# Altium schematic sheet Arduino_Shield.SchDoc
size A4; SheetNumber: 1; SheetTotal: 1
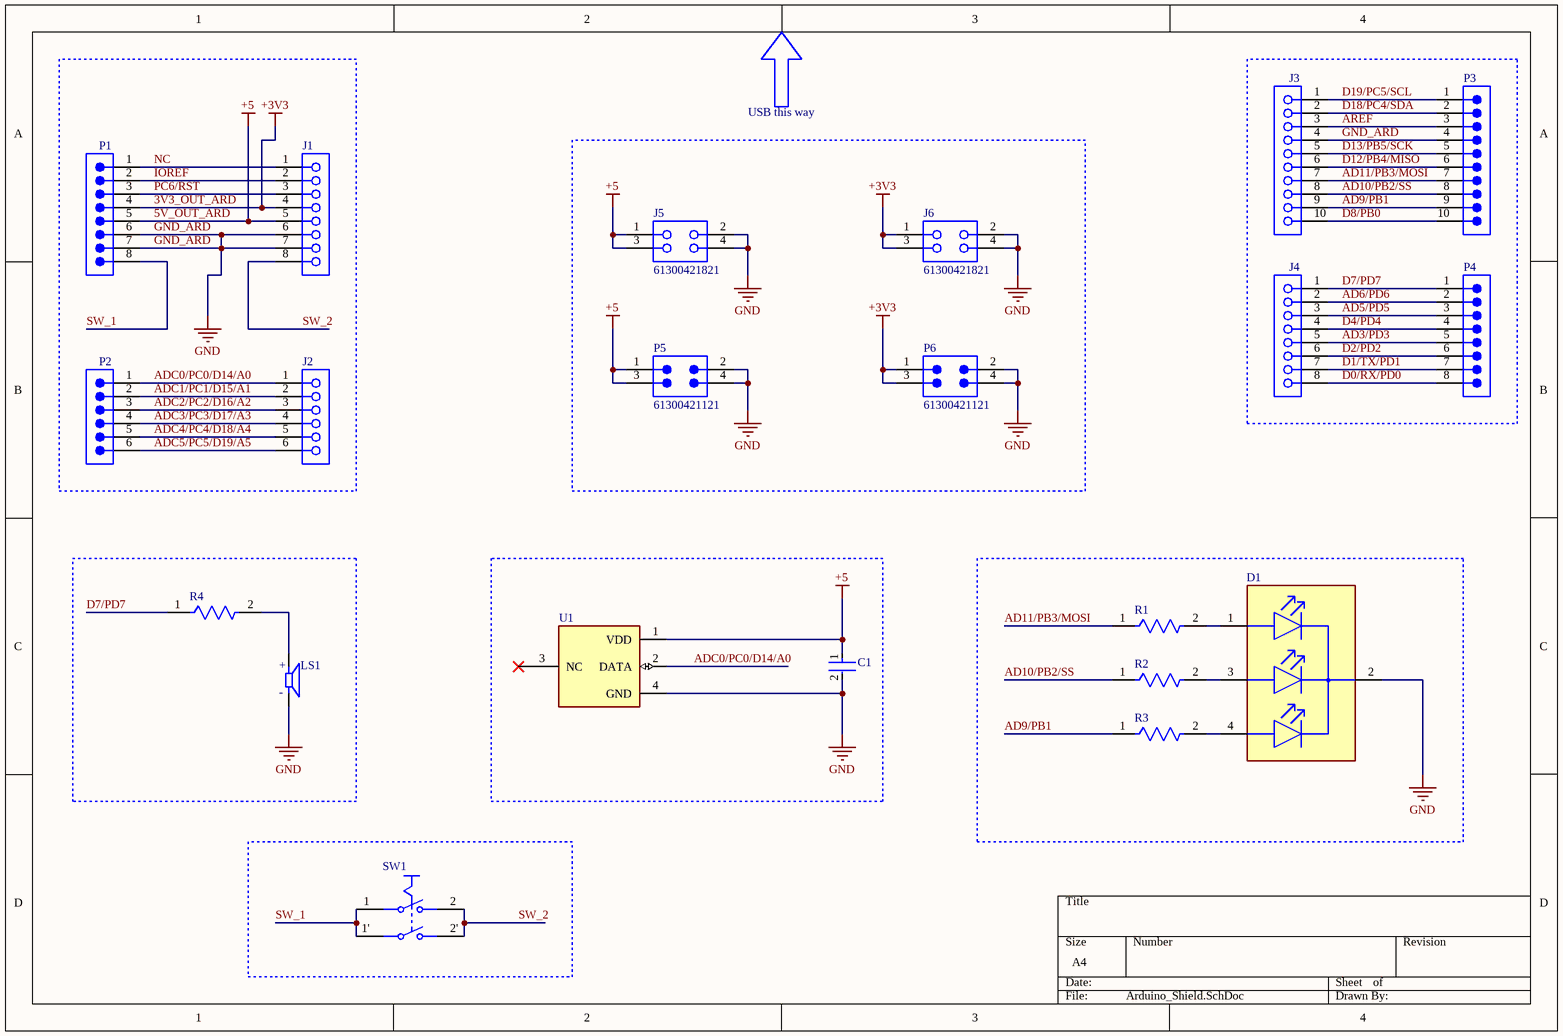
[diagram p0: Arduino_Shield.SchDoc]

## Parts
C1  C0402C104K4RACAUTO  [FP-C0402-BB-MFG]  (value not drawn)
D1  AAA3528LSEKJ3ZGKQBKS  [FP-AAA3528LSEKJ3ZGKQBKS-MFG]  (value not drawn)
J1  61300811821  [61300811821]  (value not drawn)
J2  61300611821  [61300611821]  (value not drawn)
J3  61301011821  [61301011821]  (value not drawn)
J4  61300811821  [61300811821]  (value not drawn)
J5  61300421821  [61300421821]
J6  61300421821  [61300421821]
LS1  CST-951AP  [CUI_CST-951AP]  (value not drawn)
P1  61300811121  [61300811121]  (value not drawn)
P2  61300611121  [61300611121]  (value not drawn)
P3  61301011121  [61301011121]  (value not drawn)
P4  61300811121  [61300811121]  (value not drawn)
P5  61300421121  [61300421121]
P6  61300421121  [61300421121]
R1  CPF0603F1K0C1  [FP-CPF0603-MFG]  (value not drawn)
R2  CPF0603F1K0C1  [FP-CPF0603-MFG]  (value not drawn)
R3  CPF0603F1K0C1  [FP-CPF0603-MFG]  (value not drawn)
R4  CPF0603F1K0C1  [FP-CPF0603-MFG]  (value not drawn)
SW1  PVA1EEH11.2NV2  [FP-PVA1EEH11_2NV2-MFG]  (value not drawn)
U1  ADA386  [XDCR_ADA386]  (value not drawn)

## Nets
3V3_OUT_ARD: J1.4 J6.1 J6.3 P1.4 P6.1 P6.3  [also labelled +3V3]
5V_OUT_ARD: C1.1 J1.5 J5.1 J5.3 P1.5 P5.1 P5.3 U1.1(VDD)  [also labelled +5]
GND_ARD: C1.2 D1.2(COMMON_CATHODE) J1.6 J1.7 J3.4 J5.2 J5.4 J6.2 J6.4 LS1.M P1.6 P1.7 P3.4 P5.2 P5.4 P6.2 P6.4 U1.4(GND)  [also labelled GND]
AD3/PD3: J4.5 P4.5
AD5/PD5: J4.3 P4.3
AD6/PD6: J4.2 P4.2
AD9/PB1: J3.9 P3.9 R3.1
AD10/PB2/SS: J3.8 P3.8 R2.1
AD11/PB3/MOSI: J3.7 P3.7 R1.1
ADC0/PC0/D14/A0: J2.1 P2.1 U1.2(DATA)
ADC1/PC1/D15/A1: J2.2 P2.2
ADC2/PC2/D16/A2: J2.3 P2.3
ADC3/PC3/D17/A3: J2.4 P2.4
ADC4/PC4/D18/A4: J2.5 P2.5
ADC5/PC5/D19/A5: J2.6 P2.6
AREF: J3.3 P3.3
D0/RX/PD0: J4.8 P4.8
D1/TX/PD1: J4.7 P4.7
D2/PD2: J4.6 P4.6
D4/PD4: J4.4 P4.4
D7/PD7: J4.1 P4.1 R4.1
D8/PB0: J3.10 P3.10
D12/PB4/MISO: J3.6 P3.6
D13/PB5/SCK: J3.5 P3.5
D18/PC4/SDA: J3.2 P3.2
D19/PC5/SCL: J3.1 P3.1
IOREF: J1.2 P1.2
NC: J1.1 P1.1
PC6/RST: J1.3 P1.3
SW_1: P1.8 SW1.1 SW1.1'
SW_2: J1.8 SW1.2 SW1.2'
NetD1_1: D1.1(ANODE_RED) R1.2
NetD1_3: D1.3(ANODE_GREEN) R2.2
NetD1_4: D1.4(ANODE_BLUE) R3.2
NetLS1_P: LS1.P R4.2

Not connected (* = marked no-connect by the designer): U1 3(NC)*

## Notes on the sheet
- USB this way
- (in symbol CST-951AP) +; -

## Library data of the parts
C1 = CMP-2008-03082-2: CAP CER 0.1UF 16V X7R 0402; Manufacturer: Kemet; Temperature Coefficient: 15%; Tolerance: 0.1; Capacitance: 0.10 μF; Material: Ceramic; Value: 0.10 μF; Device Class L3: Ceramic Capacitors; Voltage Rating: 16 V; Temperature Range High: +125°C; Device Class L2: Capacitors; Height: 0.55mm; Category: Cap; RoHS: TRUE; Manufacturer Part Number: C0402C104K4RACAUTO; Temperature Characteristic: X7R; Octopart: https://octopart.com/c0402c104k4racauto-kemet-17309149; Digikey Description: CAP CER 0.1UF 16V X7R 0402; Device Class L1: Passive Components; Temperature Range Low: -55°C; Mouser Description: Cap Ceramic 0.1uF 16V X7R 10% Pad SMD 0402 125C Automotive T/R; ComponentLink2Description: Datasheet; Automotive: No; Ipc Land Pattern Name: CAPC10050X50; ComponentLink2URL: https://content.kemet.com/datasheets/KEM_C1002_X7R_SMD.pdf; Lead Free: Yes; Temperature: -55°C to +125°C; Package: C0402-BB
D1 = CMP-44529-000057-1: LED RGB CLEAR 4SMD; Forward Voltage: 2.7V; Lens Color: Colorless; Luminous Intensity: 30mcd; Viewing Angle: 120°; Color: Blue; Test Current: 2mA; Dominant Wavelength: 465nm; Packaging: Tape and Reel; Width: 2.8mm; Height: 2.1mm; Lens Transparency: Clear; Mount: Surface Mount; Case/Package: PLCC; Length: 3.2mm; RoHS Compliant: Yes
J1 J4 = CMP-1502-01327-4: Btb Conn, Rcpt, 8Pos, 1Row, 2.54Mm Rohs Compliant: Yes; Contact Resistance: 20mΩ; Gender: Female; Current Rating: 3A; Operating Supply Voltage: 250V; Number of Pins: 8; Lead Pitch: 2.54mm; Orientation: Vertical; RoHS: Non-Compliant
J2 = CMP-1502-01322-4: THT Vertical Socket Header WR-PHD, Pitch 2.54 mm, Single Row, 6 pins; Current Rating: 3A; Contact Resistance: 20mΩ; Gender: Female; Operating Supply Voltage: 250V; RoHS: Compliant; Orientation: Vertical; Number of Pins: 6; Lead Pitch: 2.54mm
J3 = CMP-1502-01332-4: THT Vertical Socket Header WR-PHD, Pitch 2.54 mm, Single Row, 10 pins; Contact Resistance: 20mΩ; Connector Type: Header, Socket; Gender: Female; Number of Positions: 10; Pitch: 2.54mm; Operating Supply Voltage: 250V; Insulation Resistance: 1GΩ; Current Rating: 3A; Insulation: Insulated; Color: Black; Mount: Through Hole; Length: 25.9mm; Lead Free: Lead Free; Number of Rows: 1; Contact Gender: Female; Max Operating Temperature: 125°C; Voltage Rating: 250V; Number of Contacts: 10; Width: 25.9mm; Flammability Rating: UL94 V-0; Orientation: Vertical; Housing Material: PBT; Lead Pitch: 2.54mm; Number of Pins: 10; RoHS: Compliant; Contact Material: Copper; Termination: Through Hole; Contact Plating: Gold; Height: 8.5mm; Min Operating Temperature: -40°C
J5 J6 = CMP-1502-01318-4: THT Vertical Socket Header WR-PHD, Pitch 2.54 mm, Dual Row, 4 pins; Gender: Female; Operating Supply Voltage: 250V; Contact Resistance: 20mΩ; Current Rating: 3A; Lead Pitch: 2.54mm; Orientation: Vertical; Number of Pins: 4
LS1 = CST-951AP: 9 mm, 5 V, 85 dB, Through Hole, Magnetic Audio Transducer Buzzer; MF: Same Sky; SnapEDA_Link: https://www.snapeda.com/parts/CST-951AP/Same+Sky/view-part/?ref=snap; Package: None; Value: *; MP: CST-951AP; Check_prices: https://www.snapeda.com/parts/CST-951AP/Same+Sky/view-part/?ref=eda
P1 P4 = CMP-1502-01076-4: THT Vertical Pin Header WR-PHD, Pitch 2.54 mm, Single Row, 8 pins; Pitch: 2.54mm; Voltage Rating: 250V; Connector Type: Male Pin; Current Rating: 3A; Contact Resistance: 20mΩ; Number of Positions: 8; Gender: Male; Contact Mating Length: 5.9944mm; Orientation: Vertical; Contact Plating: Gold; Mount: Through Hole; Min Operating Temperature: -40°C; Packaging: Bulk; Height: 8.54mm; Number of Pins: 8; Contact Material: Gold; Operating Supply Voltage: 250V; Termination: Solder; RoHS: Compliant; Color: Black; Number of Contacts: 8; Lead Pitch: 2.54mm; Number of Rows: 1; Max Operating Temperature: 105°C
P2 = CMP-1502-01070-4: THT Vertical Pin Header WR-PHD, Pitch 2.54 mm, Single Row, 6 pins; Pitch: 2.54mm; Operating Supply Voltage: 250V; Connector Type: Male Pin; Gender: Male; Number of Positions: 6; Contact Resistance: 20mΩ; Current Rating: 3A; Termination: Through Hole; Color: Black; Number of Pins: 6; Lead Pitch: 2.54mm; Height: 8.89mm; RoHS: Compliant; Lead Free: Lead Free; Contact Mating Length: 5.9944mm; Contact Plating: Gold; Contact Gender: Male; Packaging: Bulk; Orientation: Vertical; Mount: Through Hole; Voltage Rating: 250V; Number of Rows: 1; Max Operating Temperature: 105°C; Min Operating Temperature: -40°C; Housing Material: PBT; Contact Material: Gold; Number of Contacts: 6
P3 = CMP-1502-01082-6: THT Vertical Pin Header WR-PHD, Pitch 2.54 mm, Single Row, 10 pins; Gender: Male; Voltage Rating: 250V; Connector Type: Male Pin; Current Rating: 3A; Number of Contacts: 10; Pitch: 2.54mm; Contact Resistance: 20mΩ; Insulation Resistance: 1GΩ; RoHS: Compliant; Length: 2.54mm; Max Operating Temperature: 105°C; Flammability Rating: UL94 V-0; Width: 25.4mm; Number of Positions: 10; Number of Rows: 1; Lead Pitch: 2.54mm; Number of Pins: 10; Termination: Solder; Operating Supply Voltage: 250V; Color: Black; Housing Material: PBT; Orientation: Vertical; Packaging: Bulk; Mount: Through Hole; Contact Mating Length: 5.9944mm; Contact Material: Gold; Height: 8.74mm; Min Operating Temperature: -40°C; Contact Plating: Gold; Contact Gender: Male
P5 P6 = CMP-1502-01066-5: THT Vertical Pin Header WR-PHD, Pitch 2.54 mm, Dual Row, 4 pins; Row Spacing: 2.54mm; Gender: Male; Number of Contacts: 4; Contact Resistance: 20mΩ; Connector Type: Male Pin; Voltage Rating: 250V; Current Rating: 3A; Height: 8.89mm; Termination: Solder; RoHS: Compliant; Color: Black; Max Operating Temperature: 105°C; Min Operating Temperature: -40°C; Contact Material: Gold; Pitch: 2.54mm; Lead Pitch: 2.54mm; Contact Plating: Gold; Number of Pins: 4; Mount: Through Hole; Number of Rows: 2; Number of Positions: 4; Orientation: Vertical; Operating Supply Voltage: 250V; Lead Free: Lead Free; Contact Mating Length: 5.9944mm; Packaging: Bulk
R1-R4 = CMP-03211-002621-1: RES SMD 1.0KΩ 1% 1/16W 0603; Manufacturer: TE Connectivity; Power Rating: 0.063W; Voltage Rating: 50V; Temperature Coefficient: 50ppm/°C; Octopart: https://octopart.com/cpf0603f1k0c1-te+connectivity-42013134; packaging: 1k Reel; Category: Res; Device Class L3: Chip SMD Resistors; octopart_url: https://octopart.com/cpf0603f1k0c1-te+connectivity-42013134; Value: 1.0KΩ; Temperature: -55°C to +155°C; Composition: Thin Film; ComponentLink2URL: https://www.te.com/commerce/DocumentDelivery/DDEController?Action=showdoc&DocId=Data+Sheet%7F1773200%7FM%7Fpdf%7FEnglish%7FENG_DS_1773200_M.pdf%7F3-1676481-2; Tolerance: 1%; Automotive: No; Lead Free: Yes; Height: 0.55mm; Device Class L1: Passive Components; Device Class L2: Resistors; Ipc Land Pattern Name: RESC15580X45; Series: CPF; ComponentLink2Description: Datasheet; RoHS: TRUE; Resistance: 1.0KΩ; Package: CPF0603; Manufacturer Part Number: CPF0603F1K0C1; Temperature Range Low: -55°C; Temperature Range High: +155°C
SW1 = CMP-10035-000009-1: SWITCH PUSH DPST 0.1A 32V; Switch Function: Off-On; Current Rating: 100mA; Electrical Life: 100000Cycles; RoHS Compliant: Yes; Throw Configuration: DPST; Max Operating Temperature: 85°C; Voltage Rating (DC): 32V; Mount: Through Hole; Series: PVA; Min Operating Temperature: -40°C; Termination: PC Pin; Packaging: Bulk
U1 = ADA386: DHT11 basic temperature-humidity sensor + extras; MF: Adafruit Industries; Value: *; Package: None; MP: ADA386; SnapEDA_Link: https://www.snapeda.com/parts/ADA386/Adafruit%20Industries/view-part/106068/?ref=snap; Price: None; Availability: Unavailable